# Altium schematic sheet Top.SchDoc
size A4; SheetNumber: 1; SheetTotal: 1
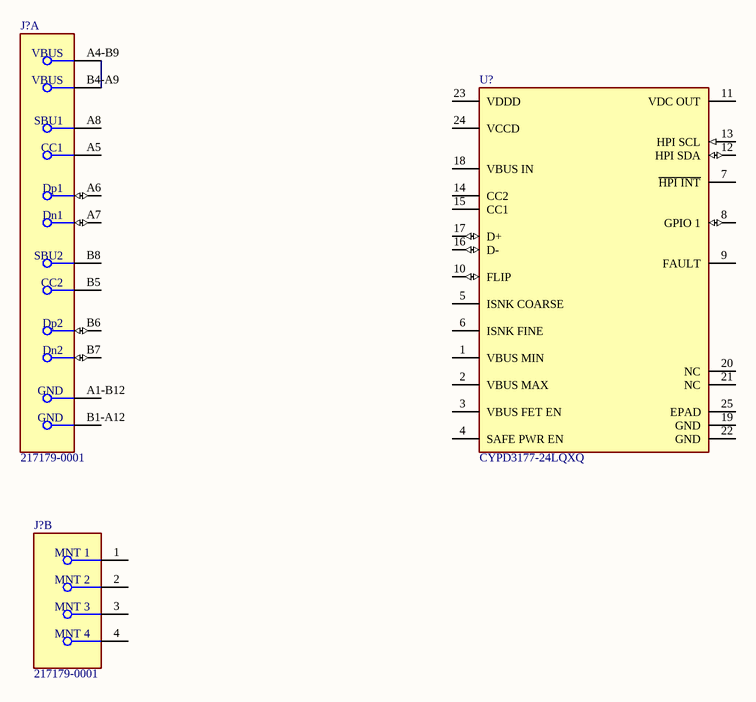
[diagram p0: Top.SchDoc]

## Parts
(Parts that share a designator on the sheet are numbered #1, #2 ... from top to bottom, then left to right.)
J?#1  217179-0001  [FP-2171790001-MFG]  (part A of 2)
J?#2  217179-0001  [FP-2171790001-MFG]  (part B of 2)
U?  CYPD3177-24LQXQ  [FP-002-16934-IPC_C]

## Nets
NetJ?#1_A4-B9: J?#1.A4-B9(VBUS) J?#1.B4-A9(VBUS)

Not connected (* = marked no-connect by the designer): J?#1 A1-B12(GND) A5(CC1) A6(Dp1) A7(Dn1) A8(SBU1) B1-A12(GND) B5(CC2) B6(Dp2) B7(Dn2) B8(SBU2); J?#2 1(MNT_1) 2(MNT_2) 3(MNT_3) 4(MNT_4); U? 1(VBUS_MIN) 2(VBUS_MAX) 3(VBUS_FET_EN) 4(SAFE_PWR_EN) 5(ISNK_COARSE) 6(ISNK_FINE) 7(~{HPI_INT}) 8(GPIO_1) 9(FAULT) 10(FLIP) 11(VDC_OUT) 12(HPI_SDA) 13(HPI_SCL) 14(CC2) 15(CC1) 16(D-) 17(D+) 18(VBUS_IN) 19(GND) 20(NC) 21(NC) 22(GND) 23(VDDD) 24(VCCD) 25(EPAD)

## Library data of the parts
J?#1 J?#2 = CMP-04767-000028-2: CONN RCP USB2.0 TYP C 24P SMD RA; NexarPartId: 117190526; Gender: Receptacle; Number of Contacts: 16; Current Rating: 1.25A; Voltage Rating: 30V; Min Operating Temperature: -40°C; USB Standard: USB 2.0; Height: 3.36mm; Contact Material: Gold, Nickel; Max Operating Temperature: 85°C
U? = CMP-12917-000005-1: IC USB TYPE-C PORT CONTROL 24QFN